# Altium schematic sheet FEV-60_Motor_Driver.SchDoc
size B; Revision: A0
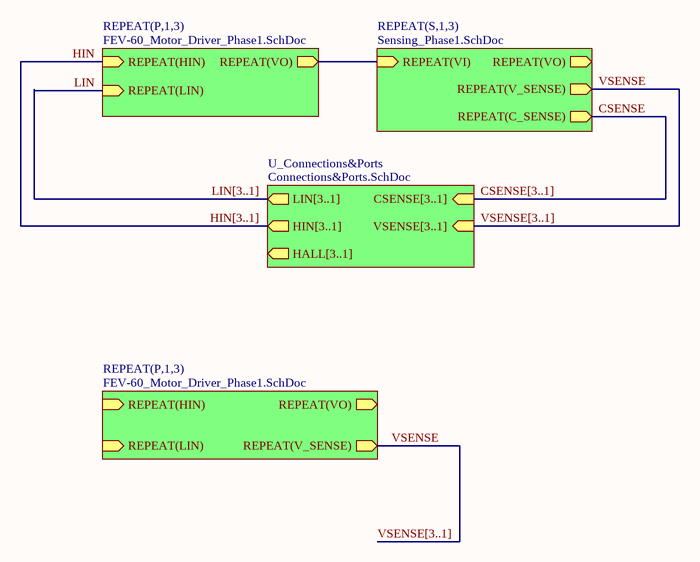
[diagram p0: FEV-60_Motor_Driver.SchDoc]

## Sub-sheets
REPEAT(P,1,3) = FEV-60_Motor_Driver_Phase1.SchDoc: REPEAT(HIN) (in), REPEAT(LIN) (in), REPEAT(VO) (out)
REPEAT(P,1,3) = FEV-60_Motor_Driver_Phase1.SchDoc: REPEAT(HIN) (in), REPEAT(LIN) (in), REPEAT(V_SENSE) (out), REPEAT(VO) (out)
REPEAT(S,1,3) = Sensing_Phase1.SchDoc: REPEAT(VI) (in), REPEAT(VO) (out), REPEAT(C_SENSE) (out), REPEAT(V_SENSE) (out)
U_Connections&Ports = Connections&Ports.SchDoc: HALL[3..1] (out), CSENSE[3..1] (in), VSENSE[3..1] (in), LIN[3..1] (out), HIN[3..1] (out)

## Nets
CSENSE: sheet REPEAT(S,1,3)/REPEAT(C_SENSE)
HIN: sheet REPEAT(P,1,3)/REPEAT(HIN)
LIN: sheet REPEAT(P,1,3)/REPEAT(LIN)
VSENSE: sheet REPEAT(S,1,3)/REPEAT(V_SENSE), sheet REPEAT(P,1,3)/REPEAT(V_SENSE)
(unnamed): sheet REPEAT(P,1,3)/REPEAT(VO), sheet REPEAT(S,1,3)/REPEAT(VI)

## Buses and harness runs
bus CSENSE[3..1] = sheet U_Connections&Ports/CSENSE[3..1]
bus HIN[3..1] = sheet U_Connections&Ports/HIN[3..1]
bus LIN[3..1] = sheet U_Connections&Ports/LIN[3..1]
bus VSENSE[3..1]
bus VSENSE[3..1] = sheet U_Connections&Ports/VSENSE[3..1]

## Notes on the sheet
- Title
- Date:
- Revision:
- Number:
- Team Skytanic
- Sheet
- of
- Senior Design
- 2019/2020
- File: